# Altium schematic sheet CATS-GS-Sensors.SchDoc: CATS Groundstation
size A4; DocumentNumber: Overview; Revision: V1.0; SheetNumber: 4; SheetTotal: 9; Author: Luca Jost; Subtitle: Sensors
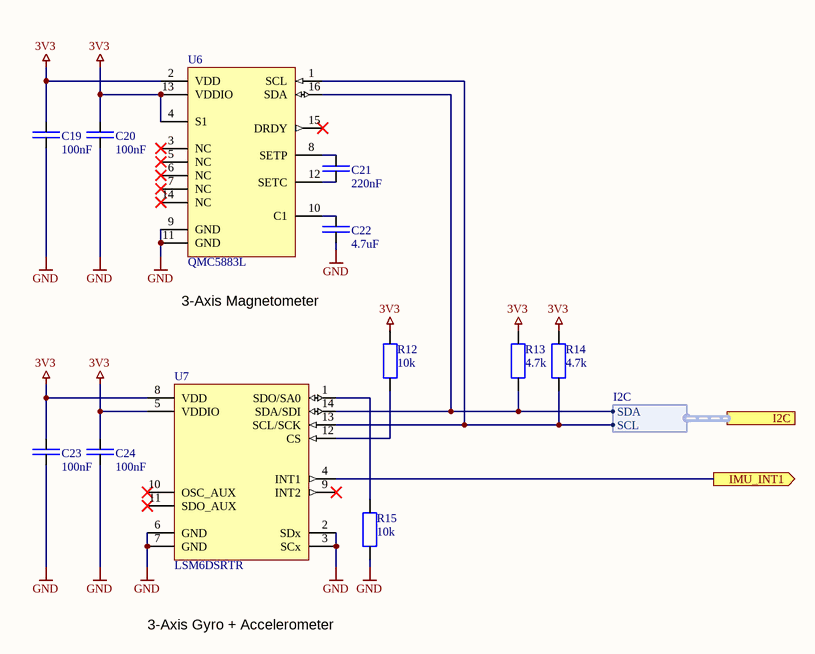
[diagram p0: CATS-GS-Sensors.SchDoc]

## Parts
C19  100nF  [SMD Keramikkondensator 0402]
C20  100nF  [SMD Keramikkondensator 0402]
C21  220nF  [SMD Keramikkondensator 0402]
C22  4.7uF  [SMD Keramikkondensator 0402]
C23  100nF  [SMD Keramikkondensator 0402]
C24  100nF  [SMD Keramikkondensator 0402]
R12  10k  [SMD Widerstand 0402]
R13  4.7k  [SMD Widerstand 0402]
R14  4.7k  [SMD Widerstand 0402]
R15  10k  [SMD Widerstand 0402]
U6  QMC5883L  [SMD IC LGA-16 4/4]
U7  LSM6DSRTR  [SMD IC LGA-14]

## Ports
I2C (harness I2C), IMU_INT1 (out)

## Harnesses
I2C: SCL, SDA

## Nets
3V3: C19.2 C20.2 C23.2 C24.2 R12.2 R13.2 R14.2 U6.2(VDD) U6.4(S1) U6.13(VDDIO) U7.5(VDDIO) U7.8(VDD)
GND: C19.1 C20.1 C22.1 C23.1 C24.1 R15.1 U6.9(GND) U6.11(GND) U7.2(SDx) U7.3(SCx) U7.6(GND) U7.7(GND)
IMU_INT1: U7.4(INT1) ; port IMU_INT1
NetC21_1: C21.1 U6.12(SETC)
NetC21_2: C21.2 U6.8(SETP)
NetC22_2: C22.2 U6.10(C1)
NetR12_1: R12.1 U7.12(CS)
NetR13_1: R13.1 U6.16(SDA) U7.14(SDA/SDI) ; port I2C.SDA
NetR14_1: R14.1 U6.1(SCL) U7.13(SCL/SCK) ; port I2C.SCL
NetR15_2: R15.2 U7.1(SDO/SA0)

Not connected (* = marked no-connect by the designer): U6 3(NC)* 5(NC)* 6(NC)* 7(NC)* 14(NC)* 15(DRDY)*; U7 9(INT2)* 10(OSC_AUX)* 11(SDO_AUX)*

## Notes on the sheet
- 3-Axis Magnetometer
- 3-Axis Gyro + Accelerometer
- Title
- Author:
- Subtitle
- Date:
- Rev:
- File:
- Sheet
- of

## Library data of the parts
C19 C20 C23 C24 = E6 - 100nF: SMD Ceramic Capacitor E6; Unit Price: 0.01; JLC: C307331
C21 = E6 - 220nF: SMD Ceramic Capacitor E6; Unit Price: 0.01; Number: -; Supplier: -; JLC: C16772
C22 = E6 - 4.7uF: SMD Ceramic Capacitor E6; Unit Price: 0.01; JLC: C23733
R12 R15 = E24 - 10k: SMD Chip Resistor E24; Unit Price: 0.01; Number: -; Supplier: -; JLC: C25744
R13 R14 = E24 - 4.7k: SMD Chip Resistor E24; Unit Price: 0.01; Number: -; Supplier: -; JLC: C25900
U6 = QMC5883L: 3-Axis Magnetic Sensor; JLC: C976032; ComponentLink1Description: Datasheet; ComponentLink1URL: https://datasheet.lcsc.com/lcsc/2012221837_QST-QMC5883L_C976032.pdf
U7 = LSM6DSRTR: Accelerometer, Gyroscope, Temperature, 6 Axis Sensor I²C, SPI Output; ComponentLink1Description: Datasheet; ComponentLink1URL: https://datasheet.lcsc.com/lcsc/2201131130_STMicroelectronics-LSM6DSRTR_C784817.pdf; JLC: C784817; Unit Price: 4.88